# EAGLE design shield v2 (EAGLE 6.1)
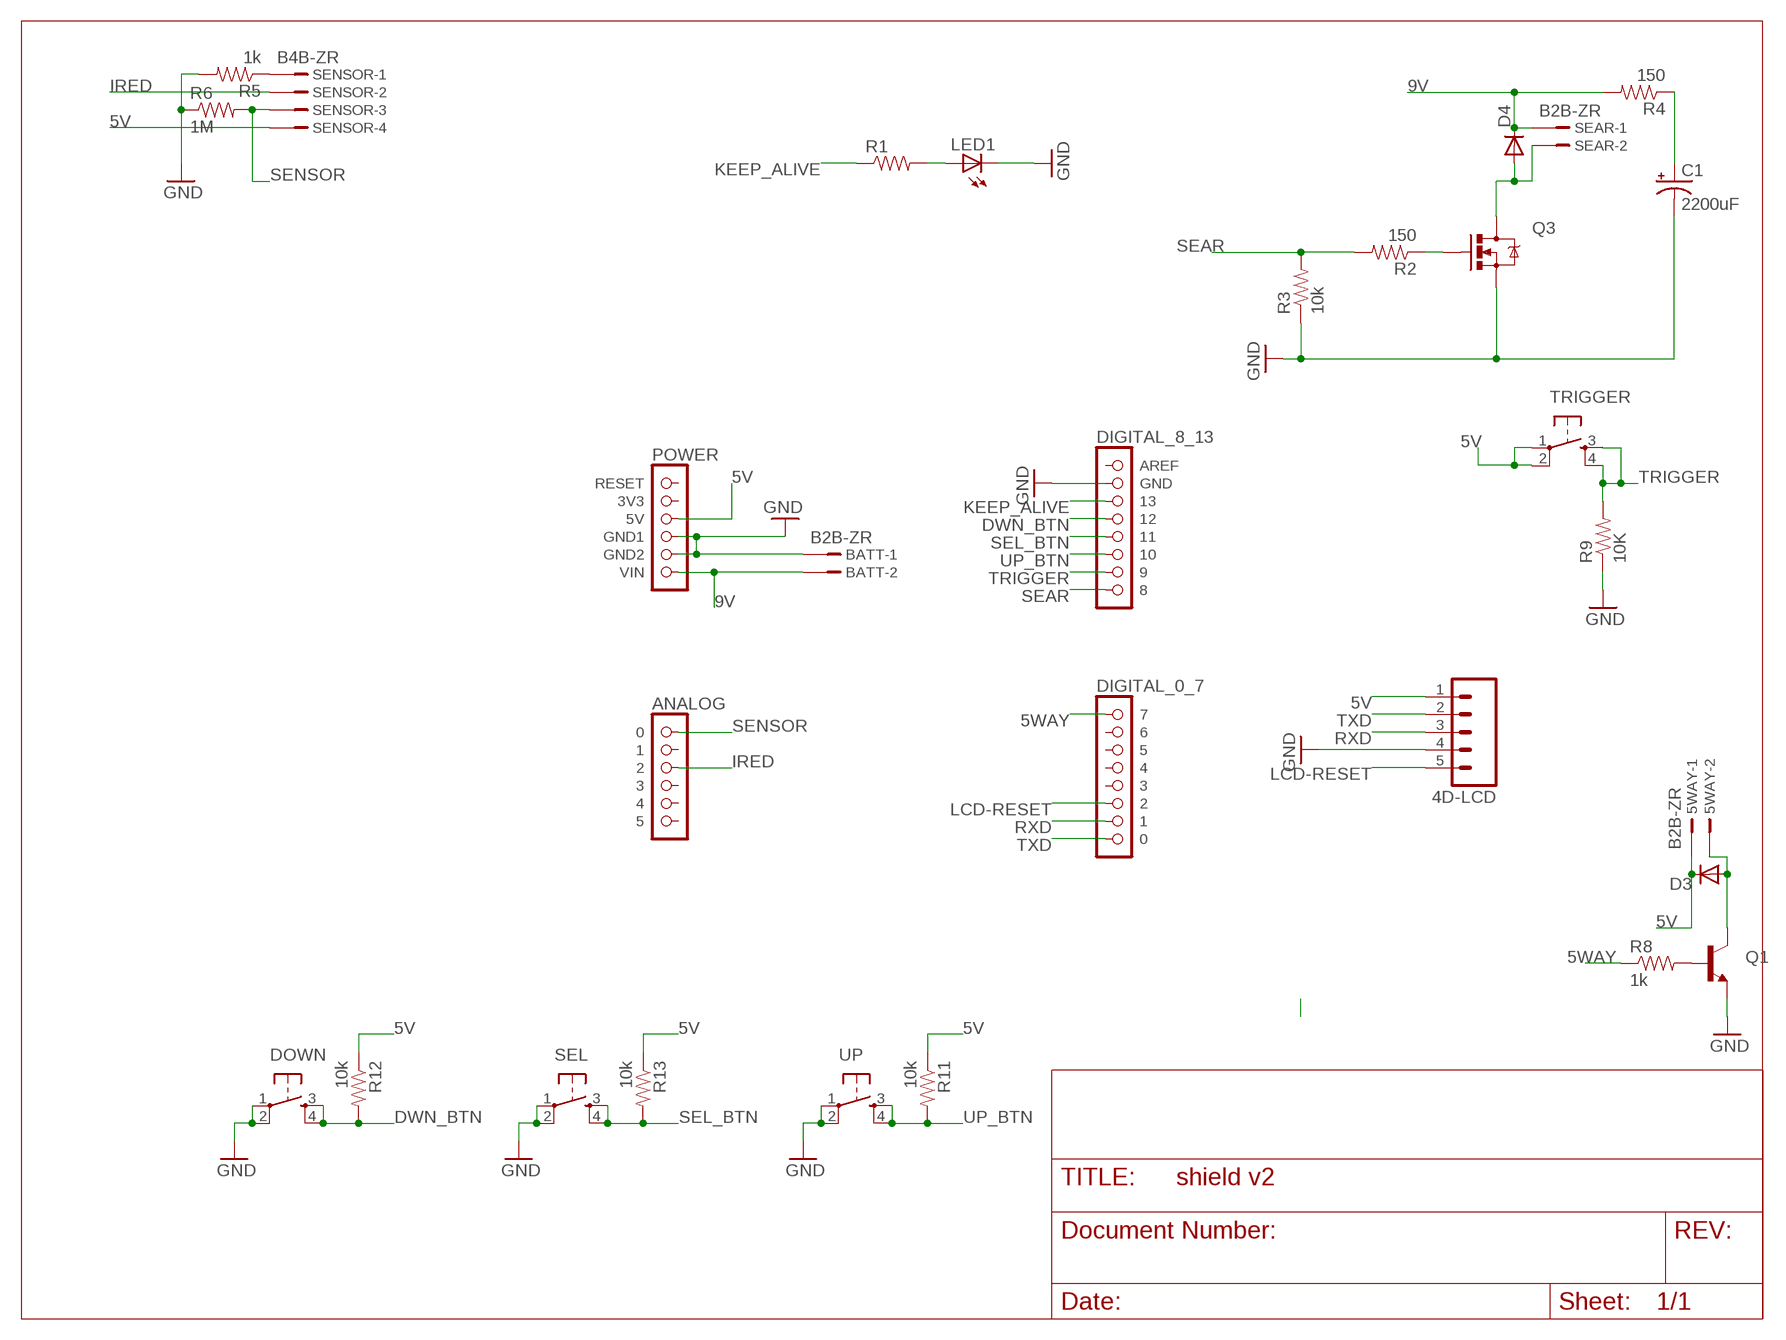
[diagram p0: schematic, sheet 1]

## Parts
4D-LCD  M05PTH  [1X05]
5WAY  B2B-ZR  [B2B-ZR@1]
BATT  B2B-ZR  [B2B-ZR]
C1  2200uF  CAP_POLPTH4  [CPOL-RADIAL-1000UF-25V]
D3  DIODEPTH  [DIODE-1N4001]
D4  DIODEPTH  [DIODE-1N4001]
DOWN  TAC_SWITCHPTH  [TACTILE-PTH]
LED1  LED3MM  [LED3MM]
Q1  TRANSISTOR_NPNTO-92-AMMO  [TO-92-AMMO]
Q3  MOSFET-NCHANNELPTH2  [TO220V]
R1  RESISTORPTH-1/4W  [AXIAL-0.4]
R2  150  RESISTORPTH-1/4W  [AXIAL-0.4]
R3  10k  RESISTORPTH-1/4W  [AXIAL-0.4]
R4  150  RESISTORPTH-1/4W  [AXIAL-0.4]
R5  1k  RESISTORPTH-1/4W  [AXIAL-0.4]
R6  1M  RESISTORPTH-1/4W  [AXIAL-0.4]
R8  1k  RESISTORPTH-1/4W  [AXIAL-0.4]
R9  10K  RESISTORPTH-1/4W  [AXIAL-0.4]
R11  10k  RESISTORPTH-1/4W  [AXIAL-0.4]
R12  10k  RESISTORPTH-1/4W  [AXIAL-0.4]
R13  10k  RESISTORPTH-1/4W  [AXIAL-0.4]
SEAR  B2B-ZR  [B2B-ZR@1]
SEL  TAC_SWITCHPTH  [TACTILE-PTH]
SENSOR  B4B-ZR  [B4B-ZR]
TRIGGER  TAC_SWITCHPTH  [TACTILE-PTH]
U$1  POWER  [1X06]
U$2  ANALOG  [1X06]
U$3  DIGITAL_0_7  [1X08]
U$4  DIGITAL_8_13  [1X08]
UP  TAC_SWITCHPTH  [TACTILE-PTH]

## Nets
5V: 4D-LCD.1 5WAY.1 D3.C R11.P$1 R12.P$1 R13.P$1 SENSOR.4 TRIGGER.1 TRIGGER.2 U$1.3(5V)
5WAY: R8.P$1 U$3.1
9V: BATT.2 D4.C R4.P$2 SEAR.1 U$1.6(VIN)
DWN_BTN: DOWN.3 DOWN.4 R12.P$2 U$4.4
GND: 4D-LCD.4 BATT.1 C1.2(-) DOWN.1 DOWN.2 LED1.K(C) Q1.1(E) Q3.3(S) R3.P$1 R5.P$2 R6.P$1 R9.P$1 SEL.1 SEL.2 U$1.4(GND1) U$1.5(GND2) U$4.2(GND) UP.1 UP.2
IRED: SENSOR.2 U$2.3
KEEP_ALIVE: R1.P$1 U$4.3
LCD-RESET: 4D-LCD.5 U$3.6
N$1: Q1.2(B) R8.P$2
N$2: LED1.A R1.P$2
N$3: Q3.1(G) R2.P$1
N$4: C1.1(+) R4.P$1
N$7: D4.A Q3.2(D) SEAR.2
N$9: R5.P$1 SENSOR.1
N$15: 5WAY.2 D3.A Q1.3(C)
RXD: 4D-LCD.3 U$3.7
SEAR: R2.P$2 R3.P$2 U$4.8
SEL_BTN: R13.P$2 SEL.3 SEL.4 U$4.5
SENSOR: R6.P$2 SENSOR.3 U$2.1
TRIGGER: R9.P$2 TRIGGER.3 TRIGGER.4 U$4.7
TXD: 4D-LCD.2 U$3.8
UP_BTN: R11.P$2 U$4.6 UP.3 UP.4
Unconnected: U$1.1(RESET) U$1.2(3V3) U$2.2 U$2.4 U$2.5 U$2.6 U$3.2 U$3.3 U$3.4 U$3.5 U$4.1(AREF)

## Library data of the parts
4D-LCD = SparkFun:M05: Header 5 Standard 5-pin 0.1" header. Use with straight break away headers (SKU : PRT-00116), right angle break away headers (PRT-00553), swiss pins (PRT-00743), machine pins (PRT-00117), and female headers (PRT-00115). Molex polarized connector foot print use with SKU : PRT-08230 with associated crimp pins and housings.
5WAY SEAR = Parts:B2B-ZR: ZH CONNECTOR 1.5 mm, 2 pin 1 row Source: http://www.jst.com .. eZH.pdf
BATT = Parts:?2B-ZR: ZH CONNECTOR 1.5 mm, 4 pin 1 row Source: http://www.jst.com .. eZH.pdf
C1 = SparkFun:CAP_POL: Capacitor Polarized These are standard SMD and PTH capacitors. Normally 10uF, 47uF, and 100uF in electrolytic and tantalum varieties. Always verify the external diameter of the through hole cap, it varies with capacity, voltage, and manufacturer. The EIA devices should be standard.
D3 D4 = SparkFun:DIODE: Diode These are standard reverse protection diodes and small signal diodes. SMA package can handle up to about 1A. SOD-323 can handle about 200mA. What the SOD-323 package when ordering, there are some mfgs out there that are 5-pin packages.
DOWN SEL TRIGGER UP = SparkFun:TAC_SWITCH: Momentary Switch Button commonly used for reset or general input. Spark Fun Electronics SKU : COM-00097
LED1 = SparkFun:LED: LEDs Standard schematic elements and footprints for 5mm, 3mm, 1206, and 0603 sized LEDs. 5mm - Spark Fun Electronics SKU : COM-00529 (and others)
Q1 = SparkFun:TRANSISTOR_NPN: Transistor NPN BJT configuration in SOT23 package. MMBT2222 is the common NPN we use. Double check BCE configuration again layout.
Q3 = SparkFun:MOSFET-NCHANNEL
R1-R6 R8 R9 R11-R13 = SparkFun:RESISTOR: Resistor Basic schematic elements and footprints for 0603, 1206, and PTH resistors.
SENSOR = con-jst:?4B-ZR: ZH CONNECTOR 1.5 mm, 4 pin 1 row Source: http://www.jst.com .. eZH.pdf; MF: FARNELL; MPN: B4B-ZR(LF)(SN); OC_FARNELL: 1830916; OC_NEWARK: 37K9960
U$1 = arduino:POWER
U$2 = arduino:ANALOG
U$3 = arduino:DIGITAL_0_7
U$4 = arduino:DIGITAL_8_13

## Board
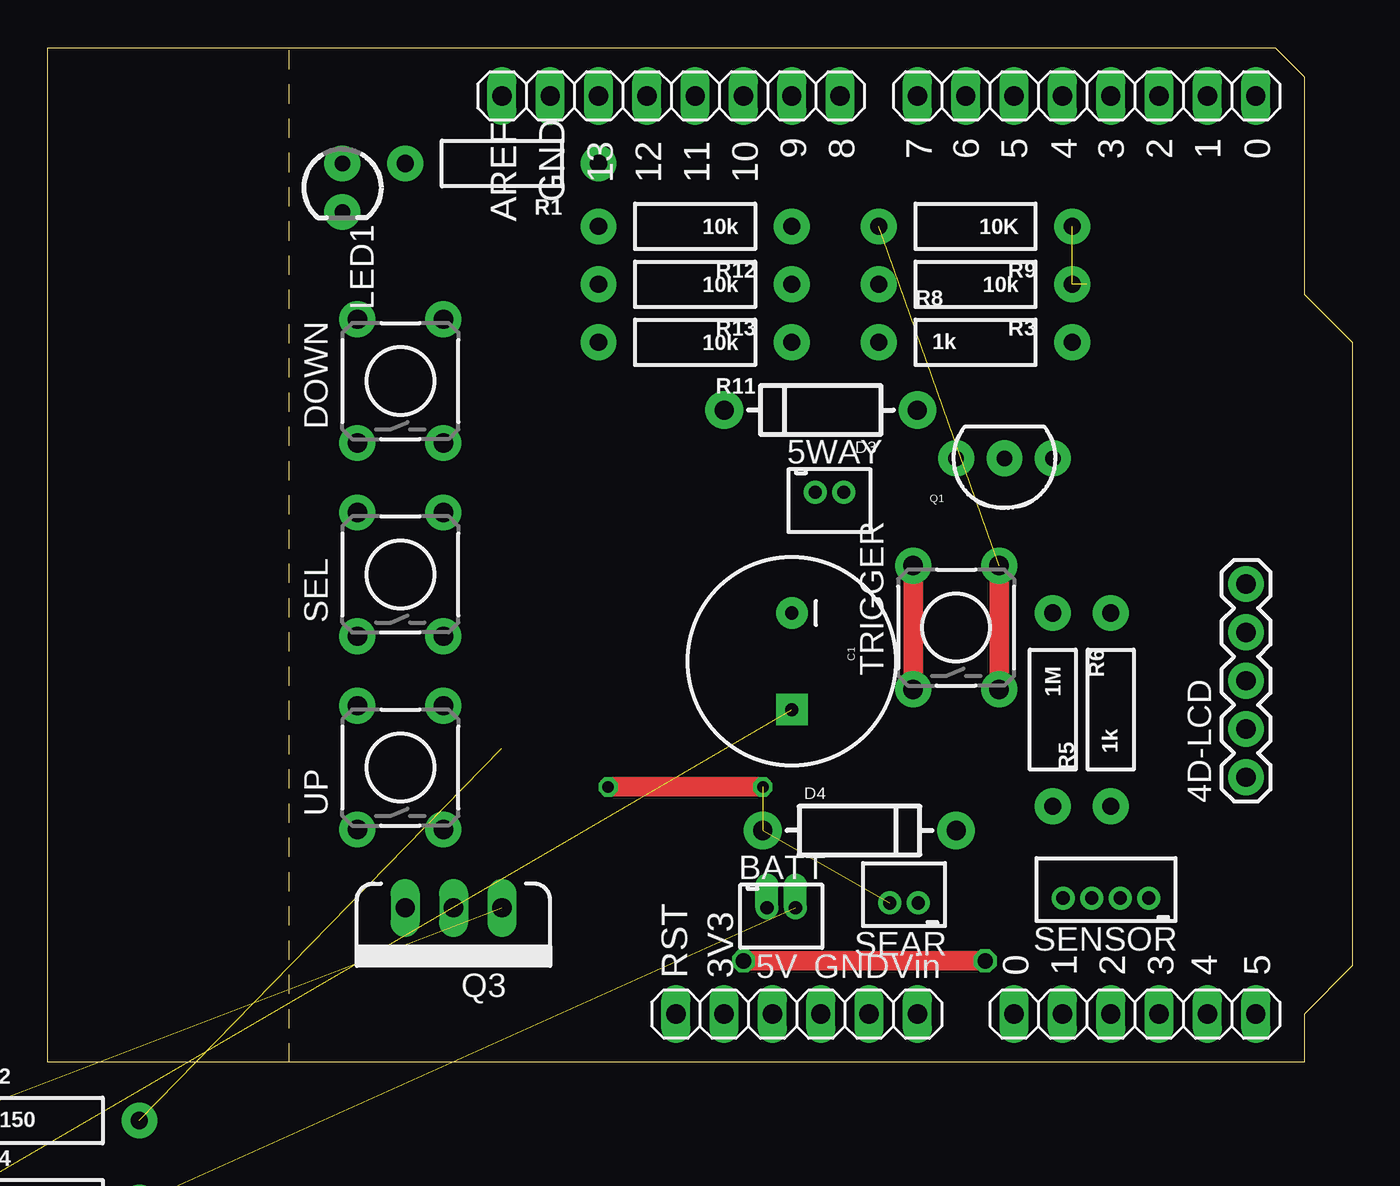
[diagram p1: board, top side]
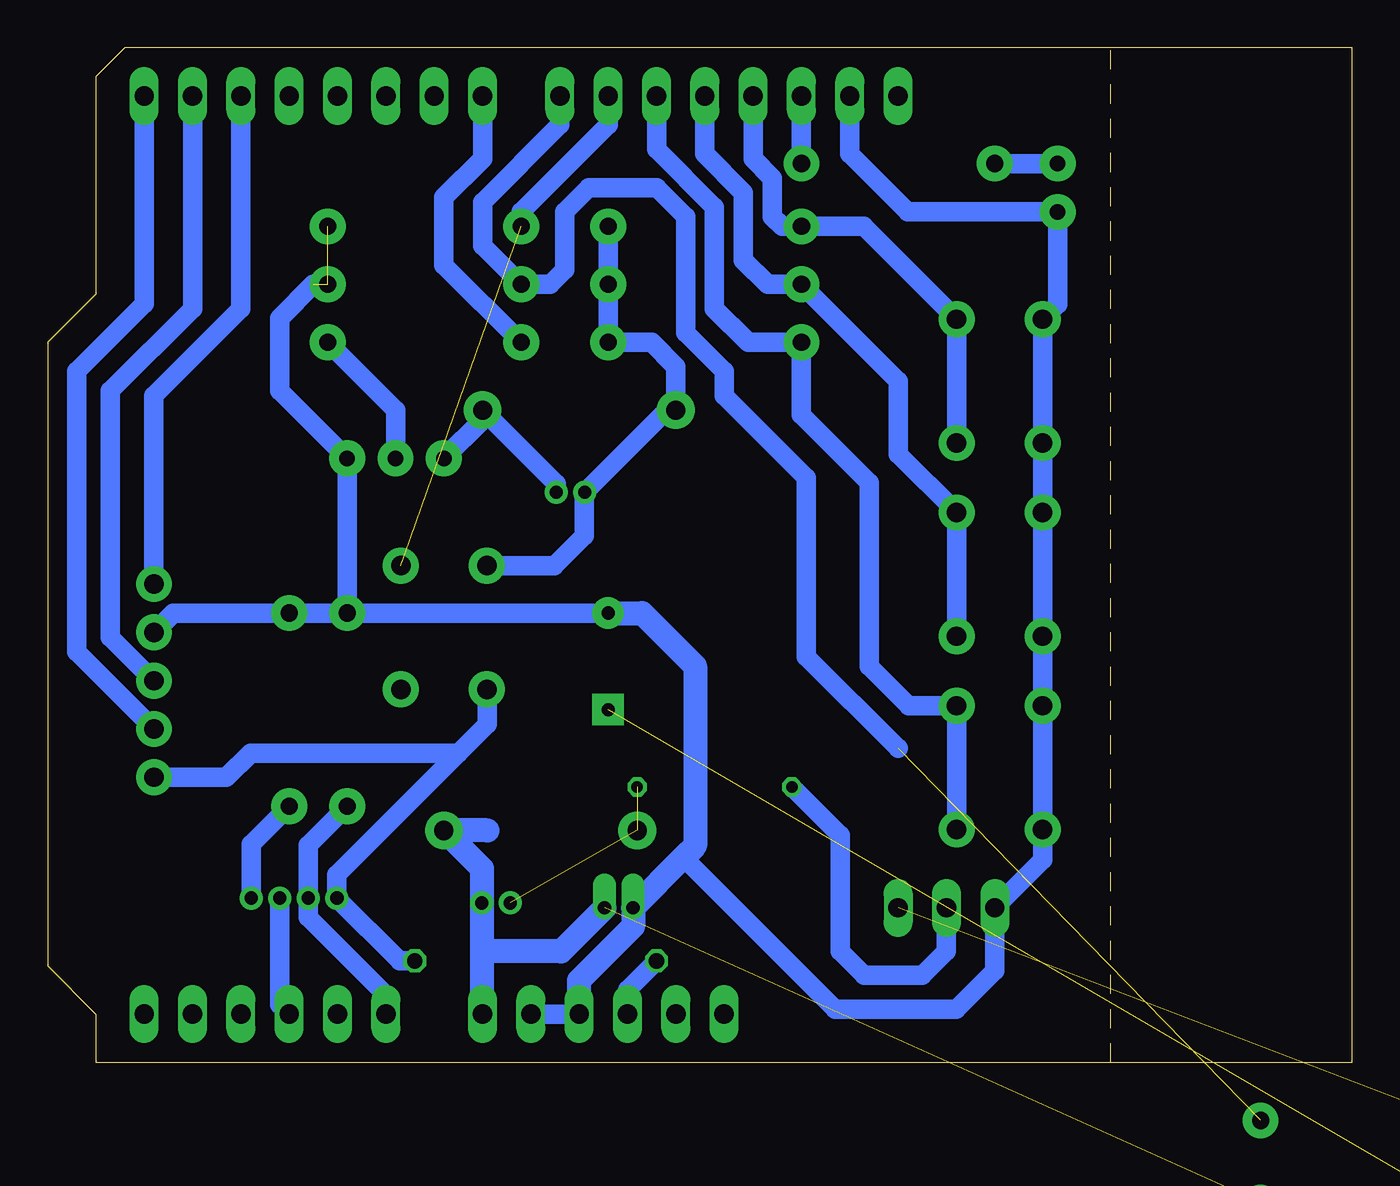
[diagram p2: board, bottom side, seen from below]

Size 68.58 x 53.34 mm. Coordinates in mm from the lower left corner, seen from the top.
Outline: 12.7,53.34 0,53.34 0,0 12.7,0
Outline: 12.7,53.34 64.52,53.34 66.04,51.82 66.04,40.39 68.58,37.85 68.58,5.08 66.04,2.54 66.04,0 12.7,0
Outline: 12.7,0 12.7,53.34
Copper layers (1*16): Top 0.035mm / dielectric 1.5mm / Bottom 0.035mm
Design rules: minimum track width 10mil, minimum drill 24mil, track to track 8mil, track to pad 8mil, pad to pad 8mil, via to via 8mil, smd to smd 8mil, copper to edge 40mil, drill to drill 8mil, minimum pad ring 10mil, minimum via ring 8mil, stop-mask expansion 4mil, vias tented up to drill 0mil, thermal gap 10mil

### Footprints (pad centres in the part's own frame; a part is rotated, then mirrored left to right if it is on the bottom)
1X05 = drill 1.016 pad 1.88: 1 0,0; 2 2.54,0; 3 5.08,0; 4 7.62,0; 5 10.16,0
B2B-ZR@1 = drill 0.7 pad 1.1: 1 -0.8,0; 2 0.7,0
B2B-ZR = drill 0.7 pad 1.1 offset: 1 -0.8,0; 2 0.7,0
CPOL-RADIAL-1000UF-25V = drill 0.7 pad 1.651 square: 1 2.54,0 | drill 0.7 pad 1.651: 2 -2.54,0
DIODE-1N4001 = drill 1 pad 1.981: A -5.08,0; C 5.08,0
TACTILE-PTH = drill 1.016 pad 1.88: 1 -3.251,2.261; 2 3.251,2.261; 3 -3.251,-2.261; 4 3.251,-2.261
LED3MM = drill 0.813 pad 1.88: A -1.27,0; K 1.27,0
TO-92-AMMO = drill 0.813 pad 1.88: 1 -2.54,0; 2 0,0; 3 2.54,0
TO220V = drill 1.016 long: 1 -2.54,0; 2 0,0; 3 2.54,0
AXIAL-0.4 = drill 0.9 pad 1.88: P$1 -5.08,0; P$2 5.08,0
B4B-ZR = drill 0.7 pad 1.1: 1 -2.25,0; 2 -0.75,0; 3 0.75,0; 4 2.25,0
1X06 = drill 1.016 long: 1 -6.35,0; 2 -3.81,0; 3 -1.27,0; 4 1.27,0; 5 3.81,0; 6 6.35,0
1X08 = drill 1.016 long: 1 -8.89,0; 2 -6.35,0; 3 -3.81,0; 4 -1.27,0; 5 1.27,0; 6 3.81,0; 7 6.35,0; 8 8.89,0

### Placement (x,y rotation side)
4D-LCD  62.99,14.99 90 top
5WAY  41.15,29.97 0 top
BATT  38.61,8.13 0 top
C1  39.12,21.08 270 top
D3  40.64,34.29 180 top
D4  42.67,12.19 0 top
DOWN  18.54,35.81 90 top
LED1  15.49,45.97 270 top
Q1  50.29,31.75 180 top
Q3  21.34,8.13 180 top
R1  23.88,47.24 180 top
R2  -0.25,-3.05 0 top  (outside the outline)
R3  48.77,40.89 180 top
R4  -0.25,-7.37 0 top  (outside the outline)
R5  55.88,18.54 90 top
R6  52.83,18.54 270 top
R8  48.77,37.85 0 top
R9  48.77,43.94 180 top
R11  34.04,37.85 180 top
R12  34.04,43.94 180 top
R13  34.04,40.89 180 top
SEAR  44.96,8.38 180 top
SEL  18.54,25.65 90 top
SENSOR  55.63,8.64 180 top
TRIGGER  47.75,22.86 90 top
U$1  39.37,2.54 0 top
U$2  57.15,2.54 0 top
U$3  54.61,50.8 0 top
U$4  32.77,50.8 0 top
UP  18.54,15.49 90 top

### Tracks (layer width: path | path; a pad name or v marks a point on that pad's centre or on a via)
5V  (via drill 0.8)
  Top 1.016: v36.58,5.33 v49.28,5.33 | TRIGGER.1 TRIGGER.2
  Bottom 1.016: R12.P$1 R13.P$1 R11.P$1 36.83,37.85 35.56,36.58 D3.C 36.03,34.29 5WAY.1 40.39,29.93 40.39,27.69 41.96,26.11 TRIGGER.2 | U$1.3 38.1,3.81 v36.58,5.33 | v49.28,5.33 50.07,5.33 SENSOR.4 53.38,9.87 46.99,16.26 | 46.99,16.26 45.47,17.78 45.47,19.58 TRIGGER.1 | 4D-LCD.1 59.18,14.99 57.91,16.26 46.99,16.26
5WAY
  Bottom 1.016: U$3.1 45.72,47.5 47.75,45.47 47.75,41.91 R8.P$1
9V  (1 unrouted)
  Bottom 1.27: 45.76,5.84 SEAR.1 45.76,10.2 D4.C 45.47,12.19 | 45.76,5.84 45.76,2.58 U$1.6 | BATT.2 41.59,5.84 45.76,5.84
DWN_BTN
  Bottom 1.016: DOWN.3 DOWN.4 25.68,43.94 R12.P$2 29.97,43.94 30.48,44.45 30.48,46.48 31.5,47.5 U$4.4
GND  (2 unrouted)
  Bottom 1.016: U$4.2 26.42,47.75 23.37,44.7 LED1.K 15.49,39.85 DOWN.2 DOWN.1 SEL.2 SEL.1 UP.2 UP.1 16.28,10.64 Q3.3 18.8,4.83 20.83,2.79 27.18,2.79 35.16,10.78 | U$1.5 U$1.4 | C1.2 R6.P$1 | R6.P$1 R5.P$2 61.98,23.62 4D-LCD.4 | R6.P$1 Q1.1 56.39,35.31 56.39,39.12 54.61,40.89
  Bottom 1.27: U$1.4 40.64,4.32 37.81,7.15 BATT.1 35.16,10.78 34.54,11.39 34.54,20.83 37.34,23.62 C1.2
IRED
  Bottom 1.016: SENSOR.2 56.38,3.04 U$2.3
KEEP_ALIVE
  Bottom 1.016: U$4.3 R1.P$1
LCD-RESET
  Bottom 1.016: 4D-LCD.5 62.99,35.05 58.42,39.62 U$3.6
N$1
  Bottom 1.016: Q1.2 50.29,34.29 R8.P$2
N$2
  Bottom 1.016: R1.P$2 LED1.A
N$3  (1 unrouted)
N$4  (1 unrouted)
N$7  (via drill 0.6)  (2 unrouted)
  Top 1.016: v29.46,14.48 v37.59,14.48
  Bottom 1.016: Q3.2 21.34,5.84 22.61,4.57 25.65,4.57 26.92,5.84 26.92,11.94 v29.46,14.48
N$9
  Bottom 1.016: SENSOR.1 57.88,11.47 R5.P$1
N$15
  Bottom 1.016: 5WAY.2 41.85,30.42 D3.A 45.72,33.78 Q1.3
RXD
  Bottom 1.016: U$3.7 60.96,39.62 65.28,35.31 65.28,22.35 4D-LCD.3
SEAR  (1 unrouted)
  Bottom 1.016: 23.88,16.51 28.7,21.34 28.7,30.73 33.02,35.05 33.02,36.32 35.05,38.35 35.05,44.45 36.58,45.97 40.13,45.97 41.4,44.7 41.4,41.66 42.16,40.89 R3.P$2 45.72,42.93 45.72,45.21 41.66,49.28 U$4.8
SEL_BTN
  Bottom 1.016: SEL.3 SEL.4 23.88,31.98 23.88,35.81 R13.P$2 30.73,40.89 32,42.16 32,45.72 34.04,47.75 U$4.5
SENSOR
  Bottom 1.016: U$2.1 50.8,3.56 54.88,7.63 SENSOR.3 54.88,11.42 R6.P$2
TRIGGER  (1 unrouted)
  Top 1.016: TRIGGER.3 TRIGGER.4
  Bottom 1.016: R9.P$2 43.69,44.7 39.12,49.28 U$4.7
TXD
  Bottom 1.016: U$3.8 63.5,39.88 67.06,36.32 67.06,21.59 4D-LCD.2
UP_BTN
  Bottom 1.016: UP.3 UP.4 23.32,18.75 25.4,20.83 25.4,30.48 28.96,34.04 R11.P$2 31.75,37.85 33.53,39.62 33.53,44.96 36.58,48.01 U$4.6

### Text on the board
tNames: 9 | 8 | 7 | 6 | 5 | 4 | 3 | 2 | 1 | 0 | 13 | 12 | 11 | 10 | GND | AREF | 0 | 1 | 2 | 3 | 4 | 5 | RST | 3V3 | 5V | GND | Vin
TallParts: USB | ISP | PWR
ArduinoHoles: 3.2mm | 2.2mm | 3.2mm